# Altium schematic sheet power.SchDoc
size A4
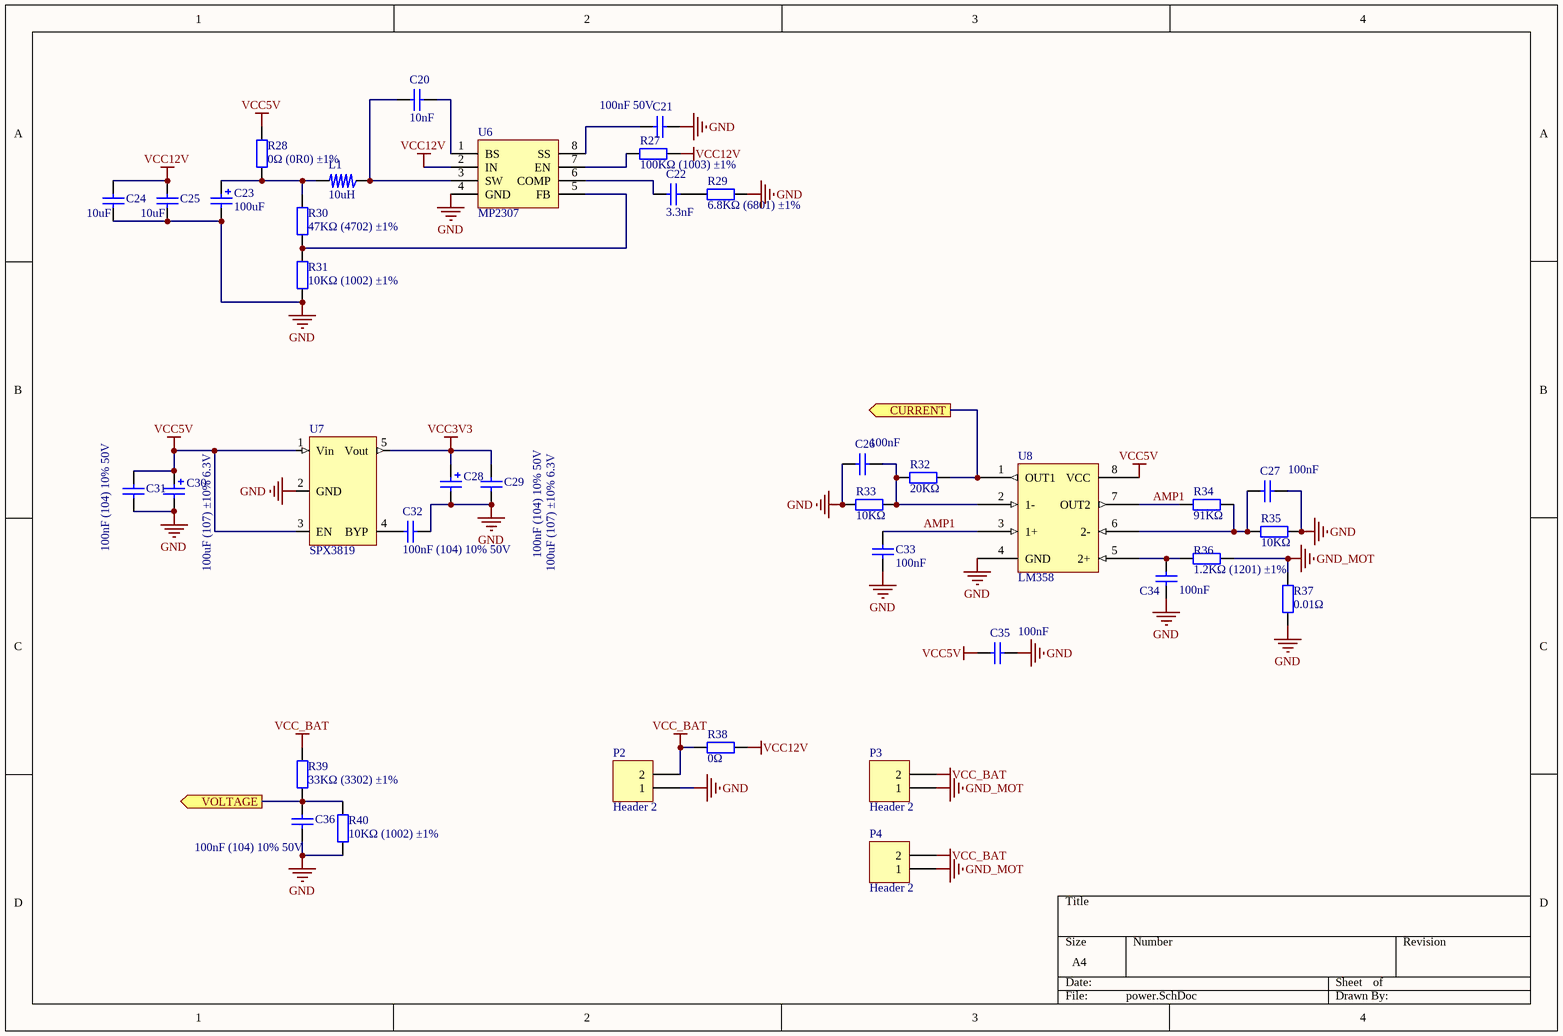
[diagram p0: power.SchDoc]

## Parts
C20  10nF  [0603_C]
C21  100nF 50V  [0603_C]
C22  3.3nF  [0603_C]
C23  100uF  [CASE-B_3528]
C24  10uF  [1206_C]
C25  10uF  [1206_C]
C26  100nF  [0603_C]
C27  100nF  [0603_C]
C28  100uF (107) ±10% 6.3V  [CASE-B_3528]
C29  100nF (104) 10% 50V  [0603_C]
C30  100uF (107) ±10% 6.3V  [CASE-B_3528]
C31  100nF (104) 10% 50V  [0603_C]
C32  100nF (104) 10% 50V  [0603_C]
C33  100nF  [0603_C]
C34  100nF  [0603_C]
C35  100nF  [0603_C]
C36  100nF (104) 10% 50V  [0603_C]
L1  10uH  [L_SOP74]
P2  Header 2  [HT508R]
P3  Header 2  [HT508R]
P4  Header 2  [HT508R]
R27  100KΩ (1003) ±1%  [0603_R]
R28  0Ω (0R0) ±1%  [0603_R]
R29  6.8KΩ (6801) ±1%  [0603_R]
R30  47KΩ (4702) ±1%  [0603_R]
R31  10KΩ (1002) ±1%  [0603_R]
R32  20KΩ  [0603_R]
R33  10KΩ  [0603_R]
R34  91KΩ  [0603_R]
R35  10KΩ  [0603_R]
R36  1.2KΩ (1201) ±1%  [0603_R]
R37  0.01Ω  [2512_R]
R38  0Ω  [1206_R]
R39  33KΩ (3302) ±1%  [0603_R]
R40  10KΩ (1002) ±1%  [0603_R]
U6  MP2307  [SOIC-8_EP_150mil]
U7  SPX3819  [SOT25-5]
U8  LM358  [SOIC-8_150mil]

## Ports
CURRENT (out), VOLTAGE (out)

## Nets
GND: C21.1 C23.2 C24.1 C25.1 C26.1 C27.2 C28.2 C29.1 C30.2 C31.2 C32.1 C33.1 C34.1 C35.2 C36.2 P2.1 R29.2 R31.1 R33.2 R35.1 R37.2 R40.1 U6.4(GND) U7.2(GND) U8.4(GND)
GND_MOT: P3.1 P4.1 R36.2 R37.1
VCC3V3: C28.1 C29.2 U7.5(Vout)
VCC5V: C30.1 C31.1 C35.1 R28.2 U7.1(Vin) U7.3(EN) U8.8(VCC)
VCC12V: C24.2 C25.2 R27.2 R38.1 U6.2(IN)
VCC_BAT: P2.2 P3.2 P4.2 R38.2 R39.2
AMP1: C33.2 R34.1 U8.3(1+) U8.7(OUT2)
CURRENT: R32.2 U8.1(OUT1) ; port CURRENT
VOLTAGE: C36.1 R39.1 R40.2 ; port VOLTAGE
NetC20_1: C20.1 U6.1(BS)
NetC20_2: C20.2 L1.1 U6.3(SW)
NetC21_2: C21.2 U6.8(SS)
NetC22_1: C22.1 U6.6(COMP)
NetC22_2: C22.2 R29.1
NetC23_1: C23.1 L1.2 R28.1 R30.2
NetC26_2: C26.2 R32.1 R33.1 U8.2(1-)
NetC27_1: C27.1 R34.2 R35.2 U8.6(2-)
NetC32_2: C32.2 U7.4(BYP)
NetC34_2: C34.2 R36.1 U8.5(2+)
NetR27_1: R27.1 U6.7(EN)
NetR30_1: R30.1 R31.2 U6.5(FB)

## Library data of the parts
C20 = 0603 10nF (103) 10% 50V: 贴片电容; ComponentLink1Description: 供应商链接; ComponentLink1URL: http://www.szlcsc.com/product/details_58143.html; Package: 0603; Supplier: LC; SuppliersPartNumber: C57112
C21 C26 C27 C29 C31-C36 = 0603 100nF (104) 10% 50V: 贴片电容; ComponentLink1Description: 供应商链接; ComponentLink1URL: http://www.szlcsc.com/product/details_15331.html; Package: 0603; Supplier: LC; SuppliersPartNumber: C14663
C22 = 0603 3.3nF (332) 10% 50V: 贴片电容; ComponentLink1Description: 供应商链接; ComponentLink1URL: http://www.szlcsc.com/product/details_1965.html; Package: 0603; Supplier: LC; SuppliersPartNumber: C1613
C23 C28 C30 = 3528 100uF (107) 10% 6.3V: 钽电容; ComponentLink1Description: 供应商链接; ComponentLink1URL: http://www.szlcsc.com/product/details_16815.html; Package: 3528; Supplier: LC; SuppliersPartNumber: C16133
C24 C25 = 1206 10uF (106) 10% 50V: 贴片电容; ComponentLink1Description: 供应商链接; ComponentLink1URL: http://www.szlcsc.com/product/details_14236.html; Package: 1206; Supplier: LC; SuppliersPartNumber: C13585
L1 = L_SOP
P2-P4 = Header 2: Header, 2-Pin; LatestRevisionDate: 17-Jul-2002; LatestRevisionNote: Re-released for DXP Platform.; Publisher: Altium Limited
R27 = 0603 100KΩ (1003) 1%: 贴片电阻; ComponentLink1Description: 供应商链接; ComponentLink1URL: http://www.szlcsc.com/product/details_26546.html; Package: 0603; Supplier: LC; SuppliersPartNumber: C25803
R28 = 0603 0Ω (0R0) 1%: 贴片电阻; ComponentLink1Description: 供应商链接; ComponentLink1URL: http://www.szlcsc.com/product/details_21903.html; Package: 0603; Supplier: LC; SuppliersPartNumber: C21189
R29 = 0603 6.8KΩ (6801) 1%: 贴片电阻; ComponentLink1Description: 供应商链接; ComponentLink1URL: http://www.szlcsc.com/product/details_23939.html; Package: 0603; Supplier: LC; SuppliersPartNumber: C23212
R30 = 0603 47KΩ (4702) 1%: 贴片电阻; ComponentLink1Description: 供应商链接; ComponentLink1URL: http://www.szlcsc.com/product/details_26562.html; Package: 0603; Supplier: LC; SuppliersPartNumber: C25819
R31 R33 R35 R40 = 0603 10KΩ (1002) 1%: 贴片电阻; ComponentLink1Description: 供应商链接; ComponentLink1URL: http://www.szlcsc.com/product/details_26547.html; Package: 0603; Supplier: LC; SuppliersPartNumber: C25804
R32 = 0603 20KΩ (2002) 1%: 贴片电阻; ComponentLink1Description: 供应商链接; ComponentLink1URL: http://www.szlcsc.com/product/details_4591.html; Package: 0603; Supplier: LC; SuppliersPartNumber: C4184
R34 = 0603 91KΩ (9102) 1%: 贴片电阻; ComponentLink1Description: 供应商链接; ComponentLink1URL: http://www.szlcsc.com/product/details_23992.html; Package: 0603; Supplier: LC; SuppliersPartNumber: C23265
R36 = 0603 1.2KΩ (1201) 1%: 贴片电阻; ComponentLink1Description: 供应商链接; ComponentLink1URL: http://www.szlcsc.com/product/details_23492.html; Package: 0603; Supplier: LC; SuppliersPartNumber: C22765
R37 = 1206 100Ω (1000) 1%: 贴片电阻; ComponentLink1Description: 供应商链接; ComponentLink1URL: http://www.szlcsc.com/product/details_18589.html; Package: 1206; Supplier: LC; SuppliersPartNumber: C17901
R38 = 1206 100Ω (1000) 1%: 自恢复保险丝; ComponentLink1Description: 供应商链接; ComponentLink1URL: http://www.szlcsc.com/product/details_18589.html; Package: 1206; Supplier: LC; SuppliersPartNumber: C17901
R39 = 0603 33KΩ (3302) 1%: 贴片电阻; ComponentLink1Description: 供应商链接; ComponentLink1URL: http://www.szlcsc.com/product/details_4623.html; Package: 0603; Supplier: LC; SuppliersPartNumber: C4216
U6 = MP2307: DC-DC降压芯片